# Altium project WB-AV-4510-CAN.PrjPcb (part 1 of 2)
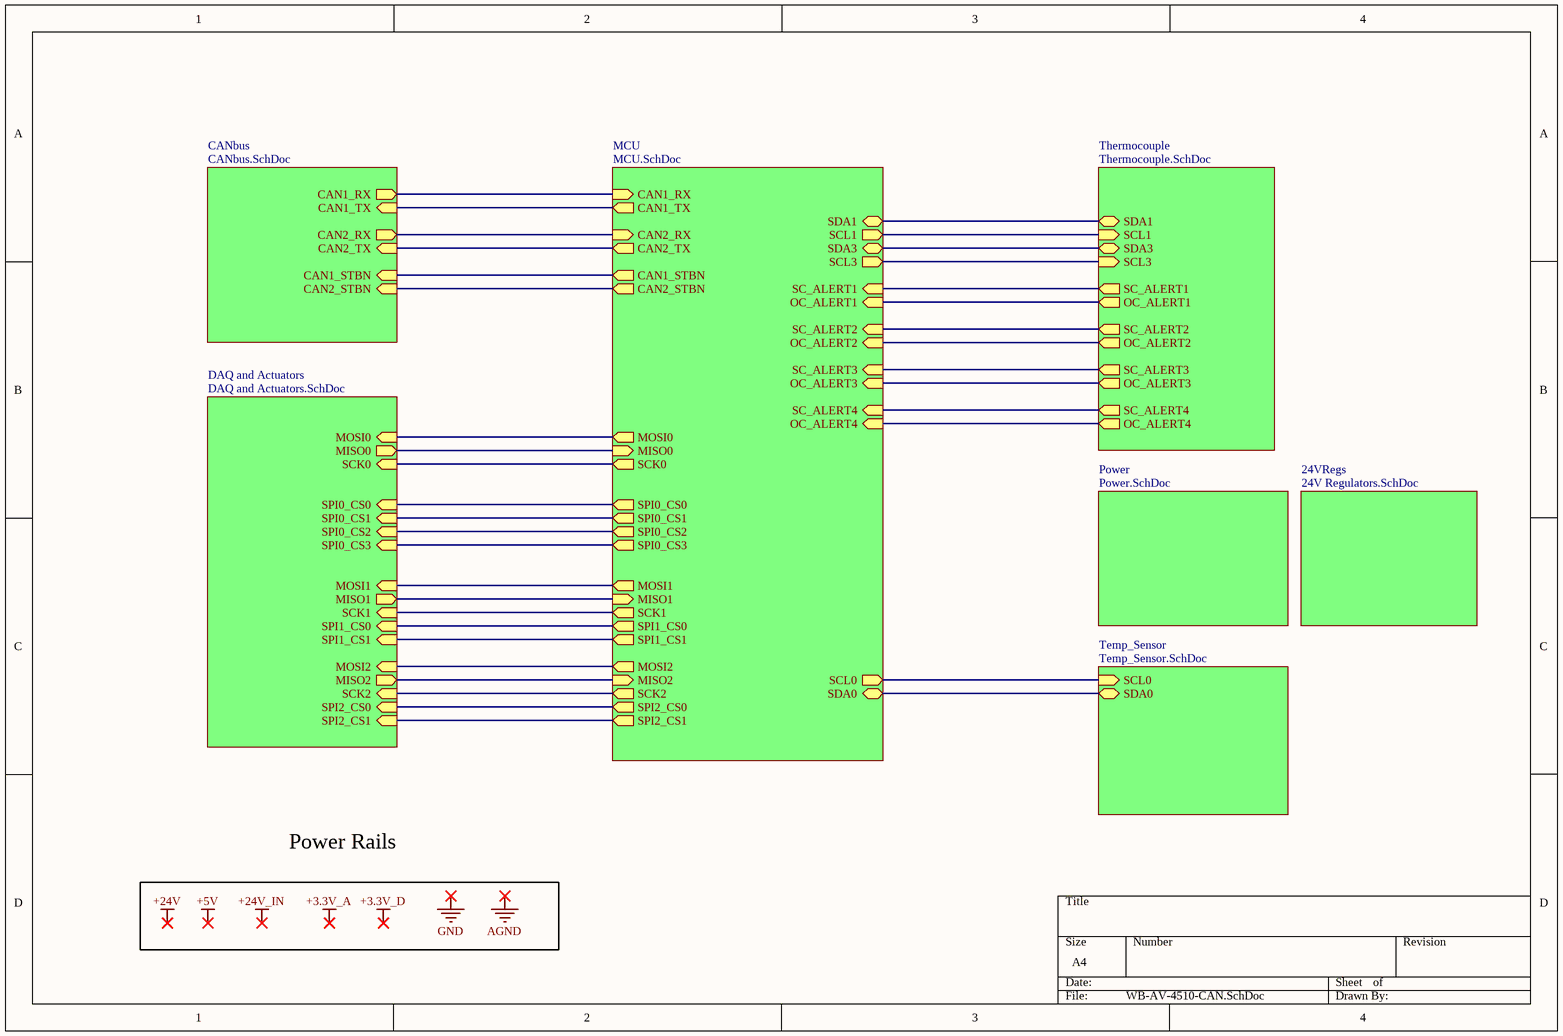
[diagram p0: WB-AV-4510-CAN.SchDoc]
8 sheets, 217 parts. Net scope: hierarchical (ports join the sheet entries above them; power ports are global).
Board file: WB-AV-4510-CAN.PcbDoc
Sheets:
  WB-AV-4510-CAN.SchDoc
    MCU = MCU.SchDoc
    CANbus = CANbus.SchDoc
    DAQ and Actuators = DAQ and Actuators.SchDoc
    Temp_Sensor = Temp_Sensor.SchDoc
    Thermocouple = Thermocouple.SchDoc
    Power = Power.SchDoc
    24VRegs = 24V Regulators.SchDoc

## Sheet WB-AV-4510-CAN.SchDoc
size A4

### Sub-sheets
24VRegs = 24V Regulators.SchDoc: no entries
CANbus = CANbus.SchDoc: CAN1_RX (out), CAN1_TX (in), CAN2_RX (out), CAN2_TX (in), CAN1_STBN (in), CAN2_STBN (in)
DAQ and Actuators = DAQ and Actuators.SchDoc: SCK0 (in), MOSI0 (in), SPI0_CS3 (in), MISO0 (out), SPI0_CS2 (in), SPI0_CS0 (in), SPI0_CS1 (in), MOSI2 (in), MISO2 (out), SCK2 (in), SPI2_CS0 (in), SPI2_CS1 (in), MOSI1 (in), MISO1 (out), SCK1 (in), SPI1_CS0 (in), SPI1_CS1 (in)
MCU = MCU.SchDoc: CAN1_RX (in), CAN1_TX (out), CAN2_RX (in), CAN2_TX (out), CAN1_STBN (out), CAN2_STBN (out), MISO0 (in), MOSI0 (out), SCK0 (out), SCL0 (out), SDA0 (bidir), SPI0_CS2 (out), SPI0_CS1 (out), SPI0_CS3 (out), SPI0_CS0 (out), SPI2_CS1 (out), MOSI2 (out), MISO2 (in), SCK2 (out), SPI2_CS0 (out), SDA1 (bidir), SCL1 (out), SDA3 (bidir), SCL3 (out), SC_ALERT1 (in), OC_ALERT1 (in), SC_ALERT2 (in), OC_ALERT2 (in), SC_ALERT3 (in), OC_ALERT3 (in), SC_ALERT4 (in), OC_ALERT4 (in), MOSI1 (out), MISO1 (in), SPI1_CS0 (out), SCK1 (out), SPI1_CS1 (out)
Power = Power.SchDoc: no entries
Temp_Sensor = Temp_Sensor.SchDoc: SCL0 (in), SDA0 (bidir)
Thermocouple = Thermocouple.SchDoc: SCL1 (in), SDA1 (bidir), SDA3 (bidir), SCL3 (in), SC_ALERT1 (out), OC_ALERT1 (out), SC_ALERT2 (out), OC_ALERT2 (out), SC_ALERT3 (out), OC_ALERT3 (out), SC_ALERT4 (out), OC_ALERT4 (out)

### Nets
MISO0: sheet MCU/MISO0, sheet DAQ and Actuators/MISO0
MISO1: sheet MCU/MISO1, sheet DAQ and Actuators/MISO1
MISO2: sheet MCU/MISO2, sheet DAQ and Actuators/MISO2
MOSI0: sheet MCU/MOSI0, sheet DAQ and Actuators/MOSI0
MOSI1: sheet MCU/MOSI1, sheet DAQ and Actuators/MOSI1
MOSI2: sheet MCU/MOSI2, sheet DAQ and Actuators/MOSI2
SCK0: sheet MCU/SCK0, sheet DAQ and Actuators/SCK0
SCK1: sheet MCU/SCK1, sheet DAQ and Actuators/SCK1
SCK2: sheet MCU/SCK2, sheet DAQ and Actuators/SCK2
SCL1: sheet MCU/SCL1, sheet Thermocouple/SCL1
SCL3: sheet MCU/SCL3, sheet Thermocouple/SCL3
SDA1: sheet MCU/SDA1, sheet Thermocouple/SDA1
SDA3: sheet MCU/SDA3, sheet Thermocouple/SDA3
SPI0_CS0: sheet MCU/SPI0_CS0, sheet DAQ and Actuators/SPI0_CS0
SPI0_CS1: sheet MCU/SPI0_CS1, sheet DAQ and Actuators/SPI0_CS1
SPI0_CS2: sheet MCU/SPI0_CS2, sheet DAQ and Actuators/SPI0_CS2
SPI0_CS3: sheet MCU/SPI0_CS3, sheet DAQ and Actuators/SPI0_CS3
SPI1_CS0: sheet MCU/SPI1_CS0, sheet DAQ and Actuators/SPI1_CS0
SPI1_CS1: sheet MCU/SPI1_CS1, sheet DAQ and Actuators/SPI1_CS1
SPI2_CS0: sheet MCU/SPI2_CS0, sheet DAQ and Actuators/SPI2_CS0
SPI2_CS1: sheet MCU/SPI2_CS1, sheet DAQ and Actuators/SPI2_CS1
NetJ2_1: sheet MCU/CAN1_TX, sheet CANbus/CAN1_TX
NetJ2_2: sheet MCU/CAN1_RX, sheet CANbus/CAN1_RX
NetJ3_1: sheet MCU/CAN2_TX, sheet CANbus/CAN2_TX
NetJ3_2: sheet MCU/CAN2_RX, sheet CANbus/CAN2_RX
NetR20_1: sheet MCU/SDA0, sheet Temp_Sensor/SDA0
NetR21_1: sheet MCU/SCL0, sheet Temp_Sensor/SCL0
NetU1A_5: sheet MCU/CAN1_STBN, sheet CANbus/CAN1_STBN
NetU1B_5: sheet MCU/CAN2_STBN, sheet CANbus/CAN2_STBN
NetU4_123: sheet MCU/OC_ALERT3, sheet Thermocouple/OC_ALERT3
NetU4_124: sheet MCU/SC_ALERT3, sheet Thermocouple/SC_ALERT3
NetU4_125: sheet MCU/OC_ALERT2, sheet Thermocouple/OC_ALERT2
NetU4_126: sheet MCU/SC_ALERT2, sheet Thermocouple/SC_ALERT2
NetU4_127: sheet MCU/OC_ALERT1, sheet Thermocouple/OC_ALERT1
NetU4_128: sheet MCU/SC_ALERT1, sheet Thermocouple/SC_ALERT1
NetU4_129: sheet MCU/OC_ALERT4, sheet Thermocouple/OC_ALERT4
NetU4_130: sheet MCU/SC_ALERT4, sheet Thermocouple/SC_ALERT4

### Notes on the sheet
- Power Rails
- Labels drawn without touching a wire or pin: +3.3V_A, +3.3V_D, +5V, +24V, +24V_IN, AGND, GND

## Sheet MCU.SchDoc
size A3
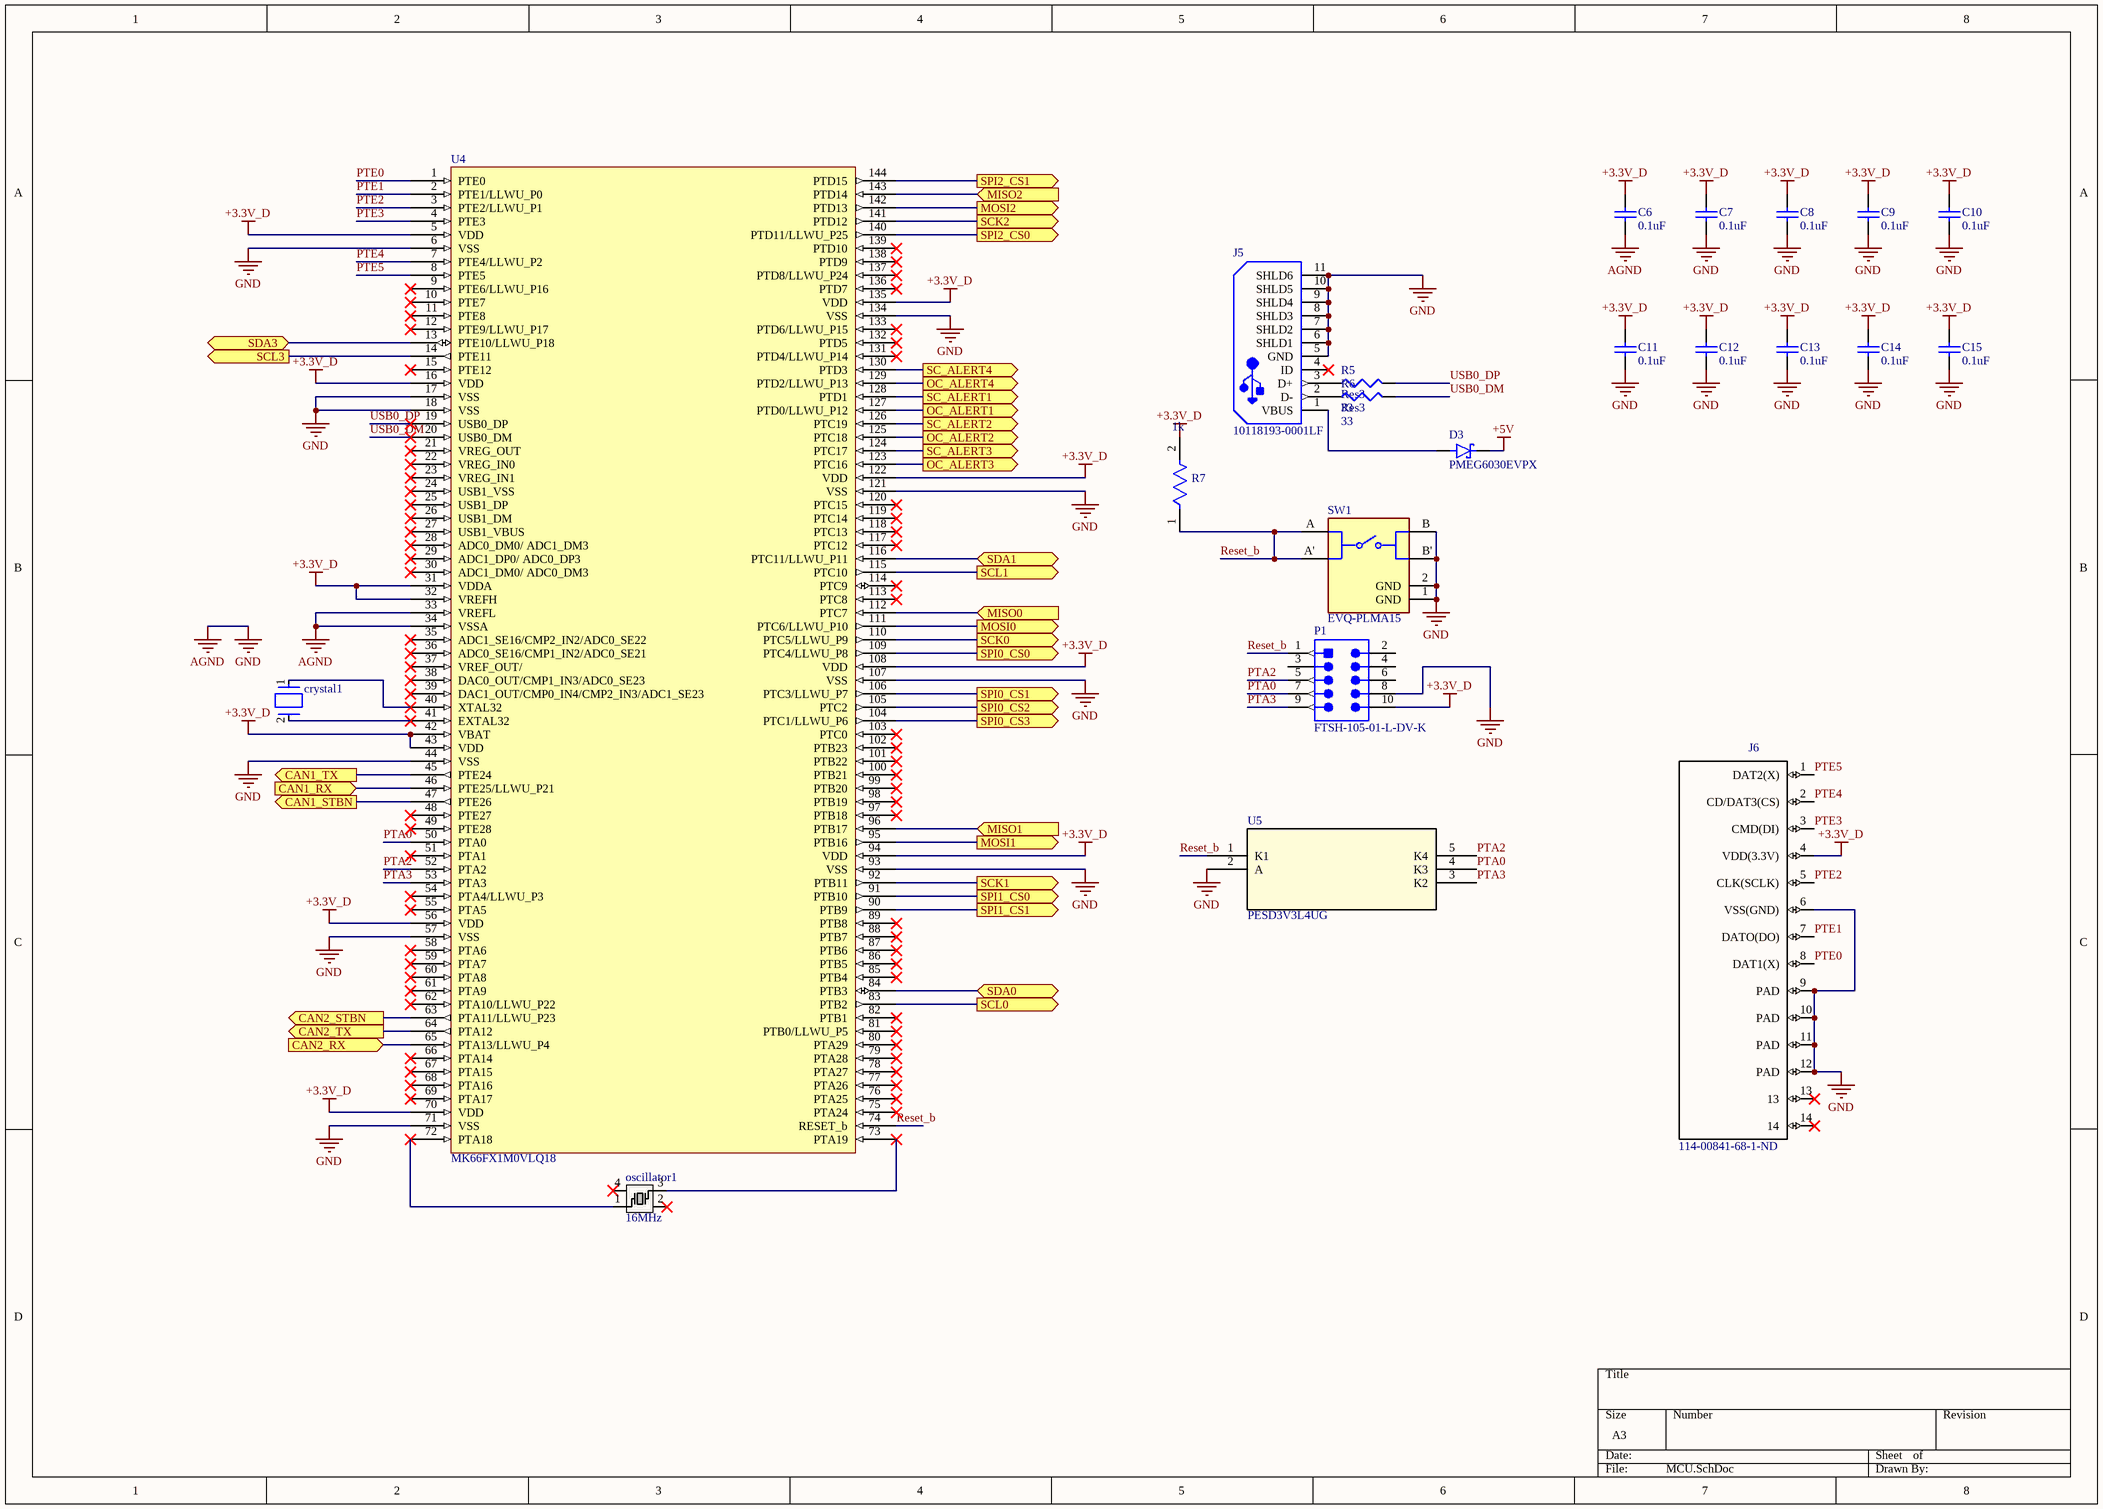
[diagram p1: MCU.SchDoc]

### Parts
C6  0.1uF  [CAPC1608X90X35NL15T15]
C7  0.1uF  [CAPC1608X90X35NL15T15]
C8  0.1uF  [CAPC1608X90X35NL15T15]
C9  0.1uF  [CAPC1608X90X35NL15T15]
C10  0.1uF  [CAPC1608X90X35NL15T15]
C11  0.1uF  [CAPC1608X90X35NL15T15]
C12  0.1uF  [CAPC1608X90X35NL15T15]
C13  0.1uF  [CAPC1608X90X35NL15T15]
C14  0.1uF  [CAPC1608X90X35NL15T15]
C15  0.1uF  [CAPC1608X90X35NL15T15]
crystal1  ABS07-120-32.768KHZ-T  [FP-ABS07-120-MFG]  (value not drawn)
D3  PMEG6030EVPX  [DIO_PMEG6030EVPX]
J5  10118193-0001LF  [FCI-10118193-0001LF-5_V]
J6  Supplier Part Number 1: 114-00841-68-1-ND  [*1140084168]  (hidden comment: 1140084168)
oscillator1  value 16MHz  [ECS-160-8-30B-CKM]  (hidden comment: SMD_oscillator)
P1  FTSH-105-01-L-DV-K  [SMTC-FTSH-105-01-L-DV-K_V]
R5  Res3  value 33  [J1-0603]
R6  Res3  value 33  [J1-0603]
R7  Resistance: 1k  [FP-CRCW0603-e3-MFG]  (hidden comment: CRCW06031K00FKEA)
SW1  EVQ-PLMA15  [FP-EVQ-PLMA15-MFG]
U4  MK66FX1M0VLQ18  [98ASS23177W]
U5  PESD3V3L4UG  [SOT353_NXP]

### Ports
CAN1_RX (in), CAN1_STBN (out), CAN1_TX (out), CAN2_RX (in), CAN2_STBN (out), CAN2_TX (out), MISO0 (in), MISO1 (in), MISO2 (in), MOSI0 (out), MOSI1 (out), MOSI2 (out), OC_ALERT1 (out), OC_ALERT2 (out), OC_ALERT3 (out), OC_ALERT4 (out), SC_ALERT1 (out), SC_ALERT2 (out), SC_ALERT3 (out), SC_ALERT4 (out), SCK0 (out), SCK1 (out), SCK2 (out), SCL0 (out), SCL1 (out), SCL3 (out), SDA0 (bidir), SDA1 (bidir), SDA3 (bidir), SPI0_CS0 (out), SPI0_CS1 (out), SPI0_CS2 (out), SPI0_CS3 (out), SPI1_CS0 (out), SPI1_CS1 (out), SPI2_CS0 (out), SPI2_CS1 (out)

### Nets
+3.3V_D: C6.2 C7.2 C8.2 C9.2 C10.2 C11.2 C12.2 C13.2 C14.2 C15.2 J6.4(VDD(3.3V)) P1.10 R7.2 U4.5(VDD) U4.16(VDD) U4.31(VDDA) U4.32(VREFH) U4.42(VBAT) U4.43(VDD) U4.56(VDD) U4.70(VDD) U4.94(VDD) U4.108(VDD) U4.122(VDD) U4.135(VDD)
+5V: D3.1(K)
AGND: C6.1 C7.1 C8.1 C9.1 C10.1 C11.1 C12.1 C13.1 C14.1 C15.1 J5.5(GND) J5.6(SHLD1) J5.7(SHLD2) J5.8(SHLD3) J5.9(SHLD4) J5.10(SHLD5) J5.11(SHLD6) J6.6(VSS(GND)) J6.9(PAD) J6.10(PAD) J6.11(PAD) J6.12(PAD) P1.8 SW1.1(GND) SW1.2(GND) SW1.B SW1.B' U4.6(VSS) U4.17(VSS) U4.18(VSS) U4.33(VREFL) U4.34(VSSA) U4.44(VSS) U4.57(VSS) U4.71(VSS) U4.93(VSS) U4.107(VSS) U4.121(VSS) U4.134(VSS) U5.2(A)  [also labelled GND]
MISO0: U4.112(PTC7) ; port MISO0
MISO1: U4.96(PTB17) ; port MISO1
MISO2: U4.143(PTD14) ; port MISO2
MOSI0: U4.111(PTC6/LLWU_P10) ; port MOSI0
MOSI1: U4.95(PTB16) ; port MOSI1
MOSI2: U4.142(PTD13) ; port MOSI2
PTA0: P1.7 U4.50(PTA0) U5.4(K3)
PTA2: P1.5 U4.52(PTA2) U5.5(K4)
PTA3: P1.9 U4.53(PTA3) U5.3(K2)
PTE0: J6.8(DAT1(X)) U4.1(PTE0)
PTE1: J6.7(DATO(DO)) U4.2(PTE1/LLWU_P0)
PTE2: J6.5(CLK(SCLK)) U4.3(PTE2/LLWU_P1)
PTE3: J6.3(CMD(DI)) U4.4(PTE3)
PTE4: J6.2(CD/DAT3(CS)) U4.7(PTE4/LLWU_P2)
PTE5: J6.1(DAT2(X)) U4.8(PTE5)
Reset_b: P1.1 R7.1 SW1.A SW1.A' U4.74(RESET_b) U5.1(K1)
SCK0: U4.110(PTC5/LLWU_P9) ; port SCK0
SCK1: U4.92(PTB11) ; port SCK1
SCK2: U4.141(PTD12) ; port SCK2
SCL1: U4.115(PTC10) ; port SCL1
SCL3: U4.14(PTE11) ; port SCL3
SDA1: U4.116(PTC11/LLWU_P11) ; port SDA1
SDA3: U4.13(PTE10/LLWU_P18) ; port SDA3
SPI0_CS0: U4.109(PTC4/LLWU_P8) ; port SPI0_CS0
SPI0_CS1: U4.106(PTC3/LLWU_P7) ; port SPI0_CS1
SPI0_CS2: U4.105(PTC2) ; port SPI0_CS2
SPI0_CS3: U4.104(PTC1/LLWU_P6) ; port SPI0_CS3
SPI1_CS0: U4.91(PTB10) ; port SPI1_CS0
SPI1_CS1: U4.90(PTB9) ; port SPI1_CS1
SPI2_CS0: U4.140(PTD11/LLWU_P25) ; port SPI2_CS0
SPI2_CS1: U4.144(PTD15) ; port SPI2_CS1
USB0_DM: R6.2 U4.20(USB0_DM)
USB0_DP: R5.2 U4.19(USB0_DP)
Netcrystal1_1: crystal1.1 U4.40(XTAL32)
Netcrystal1_2: crystal1.2 U4.41(EXTAL32)
NetD3_2: D3.2(A) J5.1(VBUS)
NetJ2_1: U4.45(PTE24) ; port CAN1_TX
NetJ2_2: U4.46(PTE25/LLWU_P21) ; port CAN1_RX
NetJ3_1: U4.64(PTA12) ; port CAN2_TX
NetJ3_2: U4.65(PTA13/LLWU_P4) ; port CAN2_RX
NetJ5_2: J5.2(D-) R6.1
NetJ5_3: J5.3(D+) R5.1
Netoscillator1_1: oscillator1.1 U4.72(PTA18)
Netoscillator1_3: oscillator1.3 U4.73(PTA19)
NetR20_1: U4.84(PTB3) ; port SDA0
NetR21_1: U4.83(PTB2) ; port SCL0
NetU1A_5: U4.47(PTE26) ; port CAN1_STBN
NetU1B_5: U4.63(PTA11/LLWU_P23) ; port CAN2_STBN
NetU4_123: U4.123(PTC16) ; port OC_ALERT3
NetU4_124: U4.124(PTC17) ; port SC_ALERT3
NetU4_125: U4.125(PTC18) ; port OC_ALERT2
NetU4_126: U4.126(PTC19) ; port SC_ALERT2
NetU4_127: U4.127(PTD0/LLWU_P12) ; port OC_ALERT1
NetU4_128: U4.128(PTD1) ; port SC_ALERT1
NetU4_129: U4.129(PTD2/LLWU_P13) ; port OC_ALERT4
NetU4_130: U4.130(PTD3) ; port SC_ALERT4

Not connected (* = marked no-connect by the designer): J5 4(ID)*; J6 13* 14*; oscillator1 2* 4*; P1 2 3 4 6; U4 9(PTE6/LLWU_P16)* 10(PTE7)* 11(PTE8)* 12(PTE9/LLWU_P17)* 15(PTE12)* 21(VREG_OUT)* 22(VREG_IN0)* 23(VREG_IN1)* 24(USB1_VSS)* 25(USB1_DP)* 26(USB1_DM)* 27(USB1_VBUS)* 28(ADC0_DM0/_ADC1_DM3)* 29(ADC1_DP0/_ADC0_DP3)* 30(ADC1_DM0/_ADC0_DM3)* 35(ADC1_SE16/CMP2_IN2/ADC0_SE22)* 36(ADC0_SE16/CMP1_IN2/ADC0_SE21)* 37(VREF_OUT/)* 38(DAC0_OUT/CMP1_IN3/ADC0_SE23)* 39(DAC1_OUT/CMP0_IN4/CMP2_IN3/ADC1_SE23)* 48(PTE27)* 49(PTE28)* 51(PTA1)* 54(PTA4/LLWU_P3)* 55(PTA5)* 58(PTA6)* 59(PTA7)* 60(PTA8)* 61(PTA9)* 62(PTA10/LLWU_P22)* 66(PTA14)* 67(PTA15)* 68(PTA16)* 69(PTA17)* 75(PTA24)* 76(PTA25)* 77(PTA26)* 78(PTA27)* 79(PTA28)* 80(PTA29)* 81(PTB0/LLWU_P5)* 82(PTB1)* 85(PTB4)* 86(PTB5)* 87(PTB6)* 88(PTB7)* 89(PTB8)* 97(PTB18)* 98(PTB19)* 99(PTB20)* 100(PTB21)* 101(PTB22)* 102(PTB23)* 103(PTC0)* 113(PTC8)* 114(PTC9)* 117(PTC12)* 118(PTC13)* 119(PTC14)* 120(PTC15)* 131(PTD4/LLWU_P14)* 132(PTD5)* 133(PTD6/LLWU_P15)* 136(PTD7)* 137(PTD8/LLWU_P24)* 138(PTD9)* 139(PTD10)*

### Library data of the parts
C6-C15 = CMP-2006-04489-1: Part Number: 0603YC104JAT2A; Manufacturer: AVX Interconnect / Elco
crystal1 = CMP-2000-07587-2: CRYSTAL 32.7680KHZ 6PF SMD; Frequency Tolerance: 20ppm; Series Resistance: 60kR; ESR (Equivalent Series Resistance): 55kR; Depth: 1.5mm; Width: 0.061inch; Number of Pins: 2; Max Operating Temperature: 85°C; Length: 3.2mm; Case/Package: SMD/SMT; Series: ABS07; Lead Free: Lead Free; Min Operating Temperature: -40°C; Load Capacitance: 6pF; Packaging: Tape and Reel; Height: 0.035inch; Radiation Hardening: No; Tolerance: 20ppm; Operating Frequency: 32.768 kHz; Termination: SMD/SMT; REACH SVHC: No SVHC; RoHS Compliant: Yes; Frequency: 32.768kHz; Package Quantity: 3000; Mount: Surface Mount
D3 = PMEG6030EVPX: Diode Schottky 60V 3A Surface Mount SOD-128/CFP5; MF: Nexperia USA; Price: None; Value: *; Package: SOD-128 Nexperia; Availability: Unavailable; SnapEDA_Link: https://www.snapeda.com/parts/PMEG6030EVPX/Nexperia%20USA%20Inc./view-part/2755440/?ref=snap; MP: PMEG6030EVPX
J5 = CMP-2000-05119-1: Micro USB B Type Receptacle, -55 to 85 degC, 5-Pin SMD, RoHS, Tape and Reel; Manufacturer: FCI; Insulation Resistance: 1000MOhms; Gender: Female; Current Rating: 1.8A; Number of Contacts: 5Contact; Connector Type: MicroUSBTypeBreceptacle; Mounting Angle: Right; Datasheet Version: Rev. C, 05/2015; Packaging: Reel; Product Category: USBConnectors; Standard: USB2.0; Factory Pack Quantity: 1200; Operating Temperature Range: -55Cto+85C; Termination Style: SMD/SMT; Datasheet URL: http://datasheet.octopart.com/10118193-0001LF-FCI-datasheet-55953155.pdf; Contact Material: CopperAlloy; RoHS: Details; Contact Plating: Gold; Flammability Rating: UL94V-0; Manufacturer URL: http://www.fci.com/; Brand: FCI; Product: MicroUSBTypeBConnectors; Color: Black
J6 = 1140084168: Conn; IC Socket; Micro SD; Right Angle; PCB Mount; MicroSD Ser.; Manufacturer: Amphenol Commercial; MF: Amphenol ICC; Connector Type: Connector; Number of Contacts: 8; Gender: Receptacle; Pitch: 1.1mm; Package: None; MP: 1140084168; SnapEDA_Link: https://www.snapeda.com/parts/1140084168/Amphenol%20ICC/view-part/?ref=snap; Digi-Key_Purchase_URL: https://www.digikey.ca/product-detail/en/amphenol-icc-commercial-products/114-00841-68/114-00841-68-1-ND/2187101?utm_source=snapeda&utm_medium=aggregator&utm_campaign=symbol; Digi-Key_Part_Number: 114-00841-68-1-ND; Value: *; Supplier 1: Digi-Key; Manufacturer Part Number: 1140084168; RoHS: Yes; Category: Memory Connectors; Stock 1: 27520; Pricing 1: 1=1.28000, 10=1.13000, 25=1.06320, 50=1.01900, 100=0.97480, 250=0.88616, 500=0.79752 (USD); Mount: Surface Mount; Contact Plating: Gold; Housing Material: Polymer; Contact Material: Copper Alloy,Copper; Packaging: Tape and Reel; Orientation: Right Angle; Package Quantity: 7500; Number of Rows: 1; Termination: SMD/SMT; Length: 15.6mm; Height: 1.55mm; Depth: 11.45mm; Radiation Hardening: No; REACH SVHC: Unknown; Flammability Rating: UL94 V-0; Lead Free: Lead Free; ComponentLink1URL: https://datasheet.ciiva.com/24241/11400841-283410-24241569.pdf?src-supplier=Mouser; ComponentLink1Description: https://datasheet.ciiva.com/24241/11400841-283410-24241569.pdf?src-supplier=Mouser; ComponentLink2URL: https://datasheet.ciiva.com/28408/11400841-28408193.pdf?src-supplier=Element14; ComponentLink2Description: https://datasheet.ciiva.com/28408/11400841-28408193.pdf?src-supplier=Element14; ComponentLink3URL: https://datasheet.ciiva.com/9464/1140084168-9464901.pdf?src-supplier=Avnet; ComponentLink3Description: https://datasheet.ciiva.com/9464/1140084168-9464901.pdf?src-supplier=Avnet; ComponentLink4URL: https://datasheet.ciiva.com/48965/70323450-48965706.pdf?src-supplier=Allied+Electronics; ComponentLink4Description: https://datasheet.ciiva.com/48965/70323450-48965706.pdf?src-supplier=Allied+Electronics; ComponentLink5URL: https://datasheet.ciiva.com/16655/1140084168-16655293.pdf?src-supplier=Avnet+Europe; ComponentLink5Description: https://datasheet.ciiva.com/16655/1140084168-16655293.pdf?src-supplier=Avnet+Europe
oscillator1 = ECS-160-8-30B-CKM: SPN: XC1839CT-ND
P1 = CMP-2000-05353-1: Male Header, Pitch 1.27 mm, 2 x 5 Position, Height 6.25 mm; Manufacturer: Samtec; Pitch: 0.050"(1.27mm); Other Names: Q3937619; Number of Positions: 10; Mating Products: SFMC-105-L2-S-D-TR-ND / -CONN.05"SURFACE10POSSMT / FLE-105-01-G-DV-TR-ND / -CONNSKT1.27MM10POSDUALSMD / FLE-105-01-G-DV-A-P-ND / -CONNSKT1.27MM10POSDUALSMD / FLE-105-01-G-DV-A-ND / -CONNSKT1.27MM10POSDUALSMD / CLP-105-02-G-D-P-TR-ND / -CONNRCPT10POSDUAL.05"SMD / SAM1155-05-ND / -CONNRCPT10POSDUAL.05"SMD / SAM1154-05-ND / -CONNRCPT10POSDUAL.05"SMD / SAM1153-05-ND / -CONNRCPT10POSDUAL.05"SMD / SAM1226-05-ND / -CONNRCPT.05"10POSDUALSMD; Number of Positions Loaded: All; Connector Type: Header,Unshrouded; Product Training Modules: Board-to-BoardConnectors; Datasheet Version: Rev. ET, 10/1995; Number of Rows: 2; Standard Package: 1; Package Description: Male Header, Pitch 1.27 mm, 2 x 5 Position, Height 5.97 mm, Tail Length 4.32 mm; Contact Finish Thickness: 10µin(0.25µm); Series: FTSH; Termination: Solder; Contact Type: MalePin; Color: Black; Package Reference: FTSH-105-01-L-DV-K; Family: RectangularConnectors-Headers,MalePins; Package URL: http://suddendocs.samtec.com/prints/ftsh-1xx-xx-xxx-dv-xxx-footprint.pdf; Packaging: Tube; Mounting Type: SurfaceMount; Category: Connectors,Interconnects; Datasheet URL: http://suddendocs.samtec.com/prints/ftsh-1xx-xx-xxx-dv-xxx-mkt.pdf; Row Spacing: 0.050"(1.27mm); Manufacturer URL: http://www.samtec.com/; Contact Mating Length: 0.120"(3.05mm); Contact Finish: Gold
R5 R6 = Res3: VISHAY - CRCW060333R0FKEA. - Resistore su Chip a Mont. Superficiale, Film Spesso, 0603 [1608 Metrico], 33 ohm, Serie CRCW, 75 V; SPN: 541-2782-1-ND; Resistance: 33R; Tolerance: 1%; Temperature Coefficient: 100ppm/°C; Power Rating: 100mW; Voltage Rating: 75V; Published: 8-Jun-2000; LatestRevisionDate: 29-May-2009; LatestRevisionNote: IPC-7351 Footprint Added.; PackageReference: J1-0603; Publisher: Altium Limited; PackageDescription: Chip Resistor; Supplier 1: Digi-Key; Supplier Part Number 1: 541-33.0HCT-ND; Manufacturer: Vishay; Manufacturer Part Number: CRCW060333R0FKEA; RoHS: Yes; Category: Chip SMD Resistors; Stock 1: 59910; Pricing 1: 1=0.10000, 10=0.03300, 100=0.01340, 1000=0.00602, 2500=0.00522 (USD); Mount: Surface Mount; Case/Package: 0603; Weight: 7.1E-05oz; Case Code (Imperial): 0603; Case Code (Metric): 1608; Contact Plating: Tin; Min Operating Temperature: -55°C; Max Operating Temperature: 155°C; Composition: Thick Film; Packaging: Tape and Reel; Number of Terminations: 2; Max Power Dissipation: 100mW; Voltage Rating (DC): 75V; Package Quantity: 10; Military Standard: Not; Termination: SMD/SMT; Features: Automotive AEC-Q200; Length: 1.55mm; Height: 0.45mm; Width: 0.85mm; Depth: 0.85mm; Radiation Hardening: No; Lead Free: Lead Free; REACH SVHC: Unknown; ComponentLink1URL: https://datasheet.ciiva.com/11809/0900766b80d98afc-11809158.pdf?src-supplier=RSComponents; ComponentLink1Description: https://datasheet.ciiva.com/11809/0900766b80d98afc-11809158.pdf?src-supplier=RSComponents; ComponentLink2URL: https://datasheet.ciiva.com/7777/1697337-7777317.pdf?src-supplier=Element14; ComponentLink2Description: https://datasheet.ciiva.com/7777/1697337-7777317.pdf?src-supplier=Element14; ComponentLink3URL: https://datasheet.ciiva.com/7777/1720486-7777557.pdf?src-supplier=Element14; ComponentLink3Description: https://datasheet.ciiva.com/7777/1720486-7777557.pdf?src-supplier=Element14; ComponentLink4URL: https://datasheet.ciiva.com/16783/70201119-16783349.pdf?src-supplier=Allied+Electronics; ComponentLink4Description: https://datasheet.ciiva.com/16783/70201119-16783349.pdf?src-supplier=Allied+Electronics; ComponentLink5URL: https://datasheet.ciiva.com/7777/1720486-7777558.pdf?src-supplier=Element14; ComponentLink5Description: https://datasheet.ciiva.com/7777/1720486-7777558.pdf?src-supplier=Element14; ComponentLink6URL: https://datasheet.ciiva.com/16771/70201119-16771126.pdf?src-supplier=Allied+Electronics; ComponentLink6Description: https://datasheet.ciiva.com/16771/70201119-16771126.pdf?src-supplier=Allied+Electronics; ComponentLink7URL: https://datasheet.ciiva.com/2465/dcrcwe3-2465591.pdf?src-supplier=Digi-Key; ComponentLink7Description: https://datasheet.ciiva.com/2465/dcrcwe3-2465591.pdf?src-supplier=Digi-Key; ComponentLink8URL: https://datasheet.ciiva.com/2465/dcrcwe3-2465592.pdf?src-supplier=Digi-Key; ComponentLink8Description: https://datasheet.ciiva.com/2465/dcrcwe3-2465592.pdf?src-supplier=Digi-Key; ComponentLink9URL: https://datasheet.ciiva.com/2465/dcrcwe3-2465593.pdf?src-supplier=Digi-Key; ComponentLink9Description: https://datasheet.ciiva.com/2465/dcrcwe3-2465593.pdf?src-supplier=Digi-Key; ComponentLink10URL: https://datasheet.ciiva.com/16893/dcrcwe3-16893242.pdf?src-supplier=Avnet+Europe; ComponentLink10Description: https://datasheet.ciiva.com/16893/dcrcwe3-16893242.pdf?src-supplier=Avnet+Europe
R7 = CMP-1666-00003-5: RES Thick Film, 1kΩ, 1%, 0.1W, 100ppm/°C, 0603; Max Power Dissipation: 100mW; Voltage Rating: 75V; Max Operating Temperature: 155°C; Number of Pins: 2; Case Code (Imperial): 0603; Width: 0.033inch; Power Rating: 100mW; Number of Terminations: 2; Package Quantity: 10; Weight: 7.1E-05oz; Tolerance: 1%; Temperature Coefficient: 100ppm/°C; Military Standard: Not; Mount: Surface Mount; Voltage Rating (DC): 75V; Depth: 0.85mm; Composition: Thick Film; Radiation Hardening: No; Termination: SMD/SMT; Length: 1.55mm; Case Code (Metric): 1608; Contact Plating: Tin; Min Operating Temperature: -55°C; Packaging: Tape and Reel; Height: 0.45mm; Lead Free: Lead Free; Case/Package: 0603; Features: Automotive AEC-Q200
SW1 = CMP-05618-000006-1: SWITCH TACTILE SPST-NO 0.02A 15V; Manufacturer: Panasonic Electronic Components; Operating Force: 2.6N; Contact Resistance: 50mΩ; Contact Current Rating: 20mA; Electromechanical Life: 200000Cycles; Throw Configuration: SPST-NO; Automotive: No; Digikey Description: SWITCH TACTILE SPST-NO 0.02A 15V; Device Class L3: Tactile Switches; Device Class L2: Switches; Temperature Range Low: -20°C; ComponentLink2Description: Datasheet; RoHS: TRUE; Mount: Surface Mount; Package: 0; Height: 1.7mm; Octopart: https://octopart.com/evq-plma15-panasonic-39850235; Temperature Range High: +70°C; Device Class L1: Electromechanical; Category: Switch; Mouser Description: Tactile Switches FLAT ACT 2.6NF 4.6x3.4x1.5mm; Voltage Rating Dc: 15V; Manufacturer Part Number: EVQ-PLMA15; ComponentLink2URL: https://datasheet.ciiva.com/8164/atv0000ce2-8164994.pdf; Lead Free: Yes; Temperature: -20°C to +70°C
U4 = Component_1
U5 = PESD3V3L4UG: No Description Available; Vendor: NXP; Built_By: EMA_UL_Team; SourceLibrary: NXP_2011-11-10; Manufacturer_Part_Number: PESD3V3L4UG; Copyright: Copyright (C) 2018 Accelerated Designs. All rights reserved; RefDes: RefDes; Type: DEV

## Sheet CANbus.SchDoc
size A4
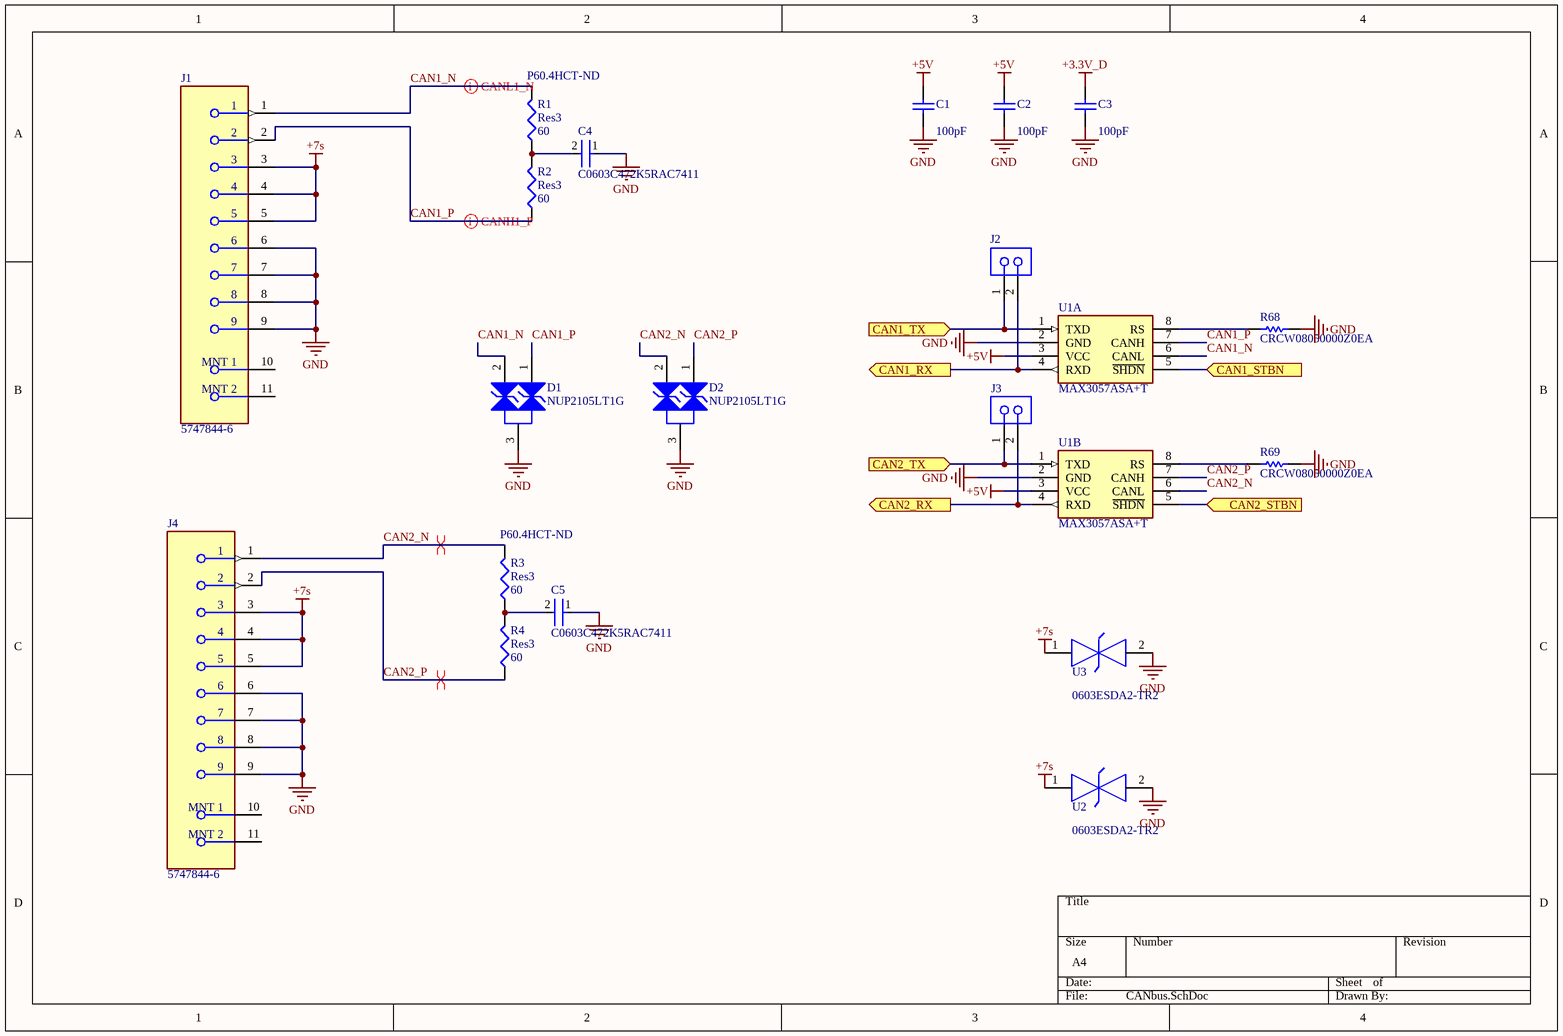
[diagram p2: CANbus.SchDoc]

### Parts
C1  value 100pF  [CAPC1608X90X35NL10T15]  (hidden comment: GRM1885C1H101JA01D)
C2  value 100pF  [CAPC1608X90X35NL10T15]  (hidden comment: GRM1885C1H101JA01D)
C3  value 100pF  [CAPC1608X90X35NL10T15]  (hidden comment: GRM1885C1H101JA01D)
C4  C0603C472K5RAC7411  [FP-C0603C-CF-MFG]
C5  C0603C472K5RAC7411  [FP-C0603C-CF-MFG]
D1  NUP2105LT1G  [ONSC-SOT-23-3-318-08_V]
D2  NUP2105LT1G  [ONSC-SOT-23-3-318-08_V]
J1  5747844-6  [FP-5747844-6-MFG]
J2  SSW-102-02-T-S  [SMTC-SSW-102-02-X-S]  (value not drawn)
J3  SSW-102-02-T-S  [SMTC-SSW-102-02-X-S]  (value not drawn)
J4  5747844-6  [FP-5747844-6-MFG]
R1  Res3  value 60  Supplier Part Number 1: P60.4HCT-ND  [J1-0603]
R2  Res3  value 60  [J1-0603]
R3  Res3  value 60  Supplier Part Number 1: P60.4HCT-ND  [J1-0603]
R4  Res3  value 60  [J1-0603]
R68  CRCW08050000Z0EA  [RESC2013X50X30LL20T20]
R69  CRCW08050000Z0EA  [RESC2013X50X30LL20T20]
U1A  MAX3057ASA+T  [SOIC127P600X175-8N]
U1B  MAX3057ASA+T  [SOIC127P600X175-8N]
U2  0603ESDA2-TR2  [Eaton_0603ESDA_0]  (value not drawn)
U3  0603ESDA2-TR2  [Eaton_0603ESDA_0]  (value not drawn)

### Ports
CAN1_RX (out), CAN1_STBN (in), CAN1_TX (in), CAN2_RX (out), CAN2_STBN (in), CAN2_TX (in)

### Nets
+3.3V_D: C3.2
+5V: C1.2 C2.2 U1A.3(VCC) U1B.3(VCC)
+7s: J1.3 J1.4 J1.5 J4.3 J4.4 J4.5 U2.1 U3.1
GND: C1.1 C2.1 C3.1 C4.1 C5.1 D1.3(K) D2.3(K) J1.6 J1.7 J1.8 J1.9 J4.6 J4.7 J4.8 J4.9 R68.2 R69.2 U1A.2(GND) U1B.2(GND) U2.2 U3.2  [project net AGND]
CAN1_N: D1.2(K) J1.1 R1.2 U1A.6(CANL)
CAN1_P: D1.1(K) J1.2 R2.1 U1A.7(CANH)
CAN2_N: D2.2(K) J4.1 R3.2 U1B.6(CANL)
CAN2_P: D2.1(K) J4.2 R4.1 U1B.7(CANH)
NetC4_2: C4.2 R1.1 R2.2
NetC5_2: C5.2 R3.1 R4.2
NetJ2_1: J2.1 U1A.1(TXD) ; port CAN1_TX
NetJ2_2: J2.2 U1A.4(RXD) ; port CAN1_RX
NetJ3_1: J3.1 U1B.1(TXD) ; port CAN2_TX
NetJ3_2: J3.2 U1B.4(RXD) ; port CAN2_RX
NetR68_1: R68.1 U1A.8(RS)
NetR69_1: R69.1 U1B.8(RS)
NetU1A_5: U1A.5(~{SHDN}) ; port CAN1_STBN
NetU1B_5: U1B.5(~{SHDN}) ; port CAN2_STBN

Not connected (* = marked no-connect by the designer): J1 10(MNT_1) 11(MNT_2); J4 10(MNT_1) 11(MNT_2)

### Layout directives
differential pair: CAN1_N, CAN1_P, CAN2_N, CAN2_P

### Library data of the parts
C1-C3 = CMP-2006-02595-1: Manufacturer: Murata; Part Number: GRM1885C1H101JA01D
C4 C5 = CMP-03020-003188-1: C0603 4,700 pF X7R 30ppm/°C 10.00% 50 V; Manufacturer: KEMET; Automotive Grade: Grade 1; Voltage Rating: 50 V; Material: Ceramic; Tolerance: 0.1; Capacitance: 4,700 pF; Manufacturer Part Number: C0603C472K5RAC7411; ComponentLink2URL: https://api.kemet.com/component-edge/download/datasheet/C0603C100J5GACAUTO.pdf; Value: 4,700 pF; RoHS: TRUE; Automotive: Yes; Package: C0603C-CF; Device Class L1: Passive Components; Temperature Coefficient: 30ppm/°C; Octopart: https://octopart.com/c0603c472k5rac7411-kemet-3746251; Temperature Range Low: -55°C; Height: 0.87mm; Device Class L2: Capacitors; Lead Free: Yes; ComponentLink2Description: Datasheet; Temperature: -55°C to +125°C; Temperature Range High: +125°C; Temperature Characteristic: X7R; Device Class L3: Ceramic Capacitors; Category: Cap
D1 D2 = CMP-1063-00164-1: Dual Line CAN Bus Protector, 3-Pin SOT-23, Pb-Free, Tape and Reel; Manufacturer: On Semiconductor; IR Max (uA): 0.1; Number of Lines: 2; Direction: Bidirectional; C Max (pF): 30; PPK Max (W): 350; V(BR) Min (V): 26.2; ComponentLink3URL: http://www.onsemi.cn/pub_link/Collateral/318-08.PDF; Mounting Technology: Surface Mount; ComponentLink2Description: Datasheet; PartNumber: NUP2105LT1G; ComponentLink1URL: http://www.onsemi.com/; PackageVersion: Rev. AP, 11/2009; DatasheetVersion: Rev. 5; RoHS: Pb-Free; PackageReference: SOT-23-3-318-08; ComponentLink2URL: http://www.onsemi.cn/pub_link/Collateral/NUP2105L-D.PDF; ComponentLink1Description: Manufacturer URL; PackageDescription: 3-Pin Small Outline Transistor, Body 2.92 x 1.3 mm, Pitch 0.95 mm; Packing: Tape and Reel; ComponentLink3Description: Package Specification
J1 J4 = CMP-2000-07496-2: CONN D-SUB RCPT 9POS R/A SOLDER; Manufacturer: TE Connectivity; Conn Gender: Female; Pitch: 2.74mm; Is Female: yes; Ciiva Ids: 587108; Current Rating: 6A; Conn Orientation: Right Angle; Number Of Contacts: 9; Import Ts: 1521841921; Shielding: true; ComponentLink2URL: https://www.te.com/commerce/DocumentDelivery/DDEController?Action=showdoc&DocId=Catalog+Section%7F82068_AMPLIMITE_Right-Angle_Posted_Conn%7F0412%7Fpdf%7FEnglish%7FENG_CS_82068_AMPLIMITE_Right-Angle_Posted_Conn_0412.pdf%7F5747844-6; Footprint Url: https://www.te.com/commerce/DocumentDelivery/DDEController?Action=showdoc&DocId=Customer+Drawing%7F5747844%7FP%7Fpdf%7FEnglish%7FENG_CD_5747844_P.pdf%7F5747844-6; ComponentLink2Description: Datasheet; Category: Conn; Height: 12.9286mm; RoHS: TRUE; Lead Free: Yes; Automotive: No; Octopart: https://octopart.com/5747844-6-te+connectivity-46505427; Package: 5747844-6; Release Date: 1508999366; Device Class L3: unset; Temperature Range High: +105°C; Contact Material: Gold,Tin; Digikey Description: CONN D-SUB RCPT 9POS R/A SOLDER; Device Class L1: Connectors; Device Class L2: D-Sub Connectors; Temperature Range Low: -55°C; Temperature: -55°C to +105°C; Mouser Description: D-Sub Standard Connectors 9 PIN RECEPTACLE; Manufacturer Part Number: 5747844-6
J2 J3 = CMP-1023-00323-1: SQ Post Socket, Through-hole, Vertical, -55 to 105 degC, 2.54 mm Pitch, 2-Pin, Female, RoHS; Manufacturer: Samtec; Pitch: 2.54 mm; ComponentLink3Description: Package Specification; ComponentLink2Description: Datasheet; ComponentLink1Description: Manufacturer URL; PackageVersion: CA, 6/1987; DatasheetVersion: F-214; PackageDescription: Assembly, Socket Strip .016 X .031 Tail; ComponentLink2URL: http://www.samtec.com/documents/webfiles/pdf/SSW_TH.PDF; RoHS: True; ComponentLink3URL: http://www.samtec.com/documents/webfiles/cpdf/SSW-1XX-XX-XXX-X-XX-XXX-XX-MKT.pdf; ComponentLink1URL: http://www.samtec.com; PackageReference: SSW-102-02-X-S; Mounting Technology: Through-hole; Orientation: Vertical; Temperature Range: -55 to 105 degC; PartNumber: SSW-102-02-T-S
R1-R4 = Res3: RESISTOR, 0603, 60R4 1%, 0.1W; Manufacturer: Panasonic; Manufacturer Part Number: ERJ-3EKF60R4V; Resistance: 60.4R; Power Rating: 100mW; Temperature Coefficient: 100ppm/°C; Voltage Rating: 75V; Voltage Rating (DC): 50V; Published: 8-Jun-2000; LatestRevisionDate: 29-May-2009; LatestRevisionNote: IPC-7351 Footprint Added.; PackageReference: J1-0603; Publisher: Altium Limited; PackageDescription: Chip Resistor; Supplier 1: Digi-Key; RoHS: Yes; Category: Chip SMD Resistors; Stock 1: 97677; Pricing 1: 1=0.10000, 10=0.05400, 100=0.02190, 1000=0.00983, 2500=0.00853 (USD); Mount: Surface Mount; Case/Package: 0603; Case Code (Metric): 1608; Case Code (Imperial): 0603; Contact Plating: Tin; Min Operating Temperature: -55°C; Max Operating Temperature: 155°C; Tolerance: 1%; Packaging: Tape and Reel; Composition: Thick Film; Number of Terminations: 2; Package Quantity: 1; Termination: SMD/SMT; Max Power Dissipation: 100mW; Military Standard: Not; Features: Automotive AEC-Q200; Length: 1.6mm; Height: 0.022inch; Width: 0.031inch; Depth: 0.8mm; REACH SVHC: No SVHC; Lead Free: Lead Free; ComponentLink1URL: https://datasheet.ciiva.com/28594/1678782-28594695.pdf?src-supplier=Element14; ComponentLink1Description: https://datasheet.ciiva.com/28594/1678782-28594695.pdf?src-supplier=Element14; ComponentLink2URL: https://datasheet.ciiva.com/30163/aoa0000ce2-30163208.pdf?src-supplier=Onlinecomponents.com; ComponentLink2Description: https://datasheet.ciiva.com/30163/aoa0000ce2-30163208.pdf?src-supplier=Onlinecomponents.com; ComponentLink3URL: https://datasheet.ciiva.com/5951/426256-5951371.pdf?src-supplier=Farnell; ComponentLink3Description: https://datasheet.ciiva.com/5951/426256-5951371.pdf?src-supplier=Farnell; ComponentLink4URL: https://datasheet.ciiva.com/16757/70260748-16757877.pdf?src-supplier=Allied+Electronics; ComponentLink4Description: https://datasheet.ciiva.com/16757/70260748-16757877.pdf?src-supplier=Allied+Electronics; ComponentLink5URL: https://datasheet.ciiva.com/24068/aoa0000ce2-24068761.pdf?src-supplier=Mouser; ComponentLink5Description: https://datasheet.ciiva.com/24068/aoa0000ce2-24068761.pdf?src-supplier=Mouser; ComponentLink6URL: https://datasheet.ciiva.com/16783/70260748-16783402.pdf?src-supplier=Allied+Electronics; ComponentLink6Description: https://datasheet.ciiva.com/16783/70260748-16783402.pdf?src-supplier=Allied+Electronics; ComponentLink7URL: https://datasheet.ciiva.com/28677/1678782-28677676.pdf?src-supplier=Element14; ComponentLink7Description: https://datasheet.ciiva.com/28677/1678782-28677676.pdf?src-supplier=Element14; ComponentLink8URL: https://datasheet.ciiva.com/43460/426256-43460428.pdf?src-supplier=Farnell; ComponentLink8Description: https://datasheet.ciiva.com/43460/426256-43460428.pdf?src-supplier=Farnell; ComponentLink9URL: https://datasheet.ciiva.com/46377/426256-46377437.pdf?src-supplier=Element14; ComponentLink9Description: https://datasheet.ciiva.com/46377/426256-46377437.pdf?src-supplier=Element14
  R2 R4: Supplier Part Number 1: P60.4HCT-ND
R68 R69 = CMP-2001-04896-1: Manufacturer: Vishay Dale; Part Number: CRCW08050000Z0EA
U1A U1B = MAX3057ASA+T: Integrated Circuit; Manufacturer_Name: Maxim Integrated; Datasheet Link: https://datasheets.maximintegrated.com/en/ds/MAX3050-MAX3057.pdf; Height: 1.75mm; Manufacturer_Part_Number: MAX3057ASA+T
U2 U3 = 0603ESDA2-TR2: DIODE SUPPRESSOR ESD 30VDC 0603 SMD; Manufacturer: Eaton; Capacitance: SKIP; Clamping Voltage: 35V; Direction: Bidirectional; Library Path1: parts/Diode_Eaton_0603ESDA2-TR2_eec.SchLib; Peak Pulse Current: 30A; Value: SKIP; Verification Version: 0.0.0.1; Part Number: 0603ESDA2-TR2; Datasheet Path: datasheets/Diode_Eaton_0603ESDA2-TR2_eec.pdf; ComponentLink1Description: Upverter; ComponentLink1URL: https://upverter.com/upn/revision/b9b7301627e297c3/; ComponentLink2Description: Datasheet; ComponentLink2URL: http://www.cooperindustries.com/content/dam/public/bussmann/Electronics/Resources/product-datasheets/bus-elx-ds-4419-0603esda2-tr2.pdf; Datasheet Path1: datasheets/Diode_Eaton_0603ESDA2-TR2_eec.pdf; Digikey Description: DIODE SUPPRESSOR ESD 30VDC 0603 SMD; Digikey Part Number: 283-4156-1-ND; Height: 0.7mm; Inductance: SKIP; Lead Free: yes; Library Ref1: 0603ESDA2-TR2; Mouser Description: MLP Series 60 V 0.1 pF Bi-Directional 0603 Surface Mount ESD Suppressor; Mouser Part Number: 504-0603ESDA2-TR2; Package: 0603ESDA; Price: 0.211194288872; Resistance: SKIP; RoHS: TRUE; Supplier 1: Digi-Key; Supplier 2: Mouser; Supplier Part Number 1: 283-4156-1-ND; Supplier Part Number 2: 504-0603ESDA2-TR2; Temperature: -55°C to +105°C; Temperature Range High: +105°C; Temperature Range Low: -55°C; Voltage: SKIP; helpURL: https://upverter.com/upn/revision/b9b7301627e297c3/

## Sheet DAQ and Actuators.SchDoc
size A3
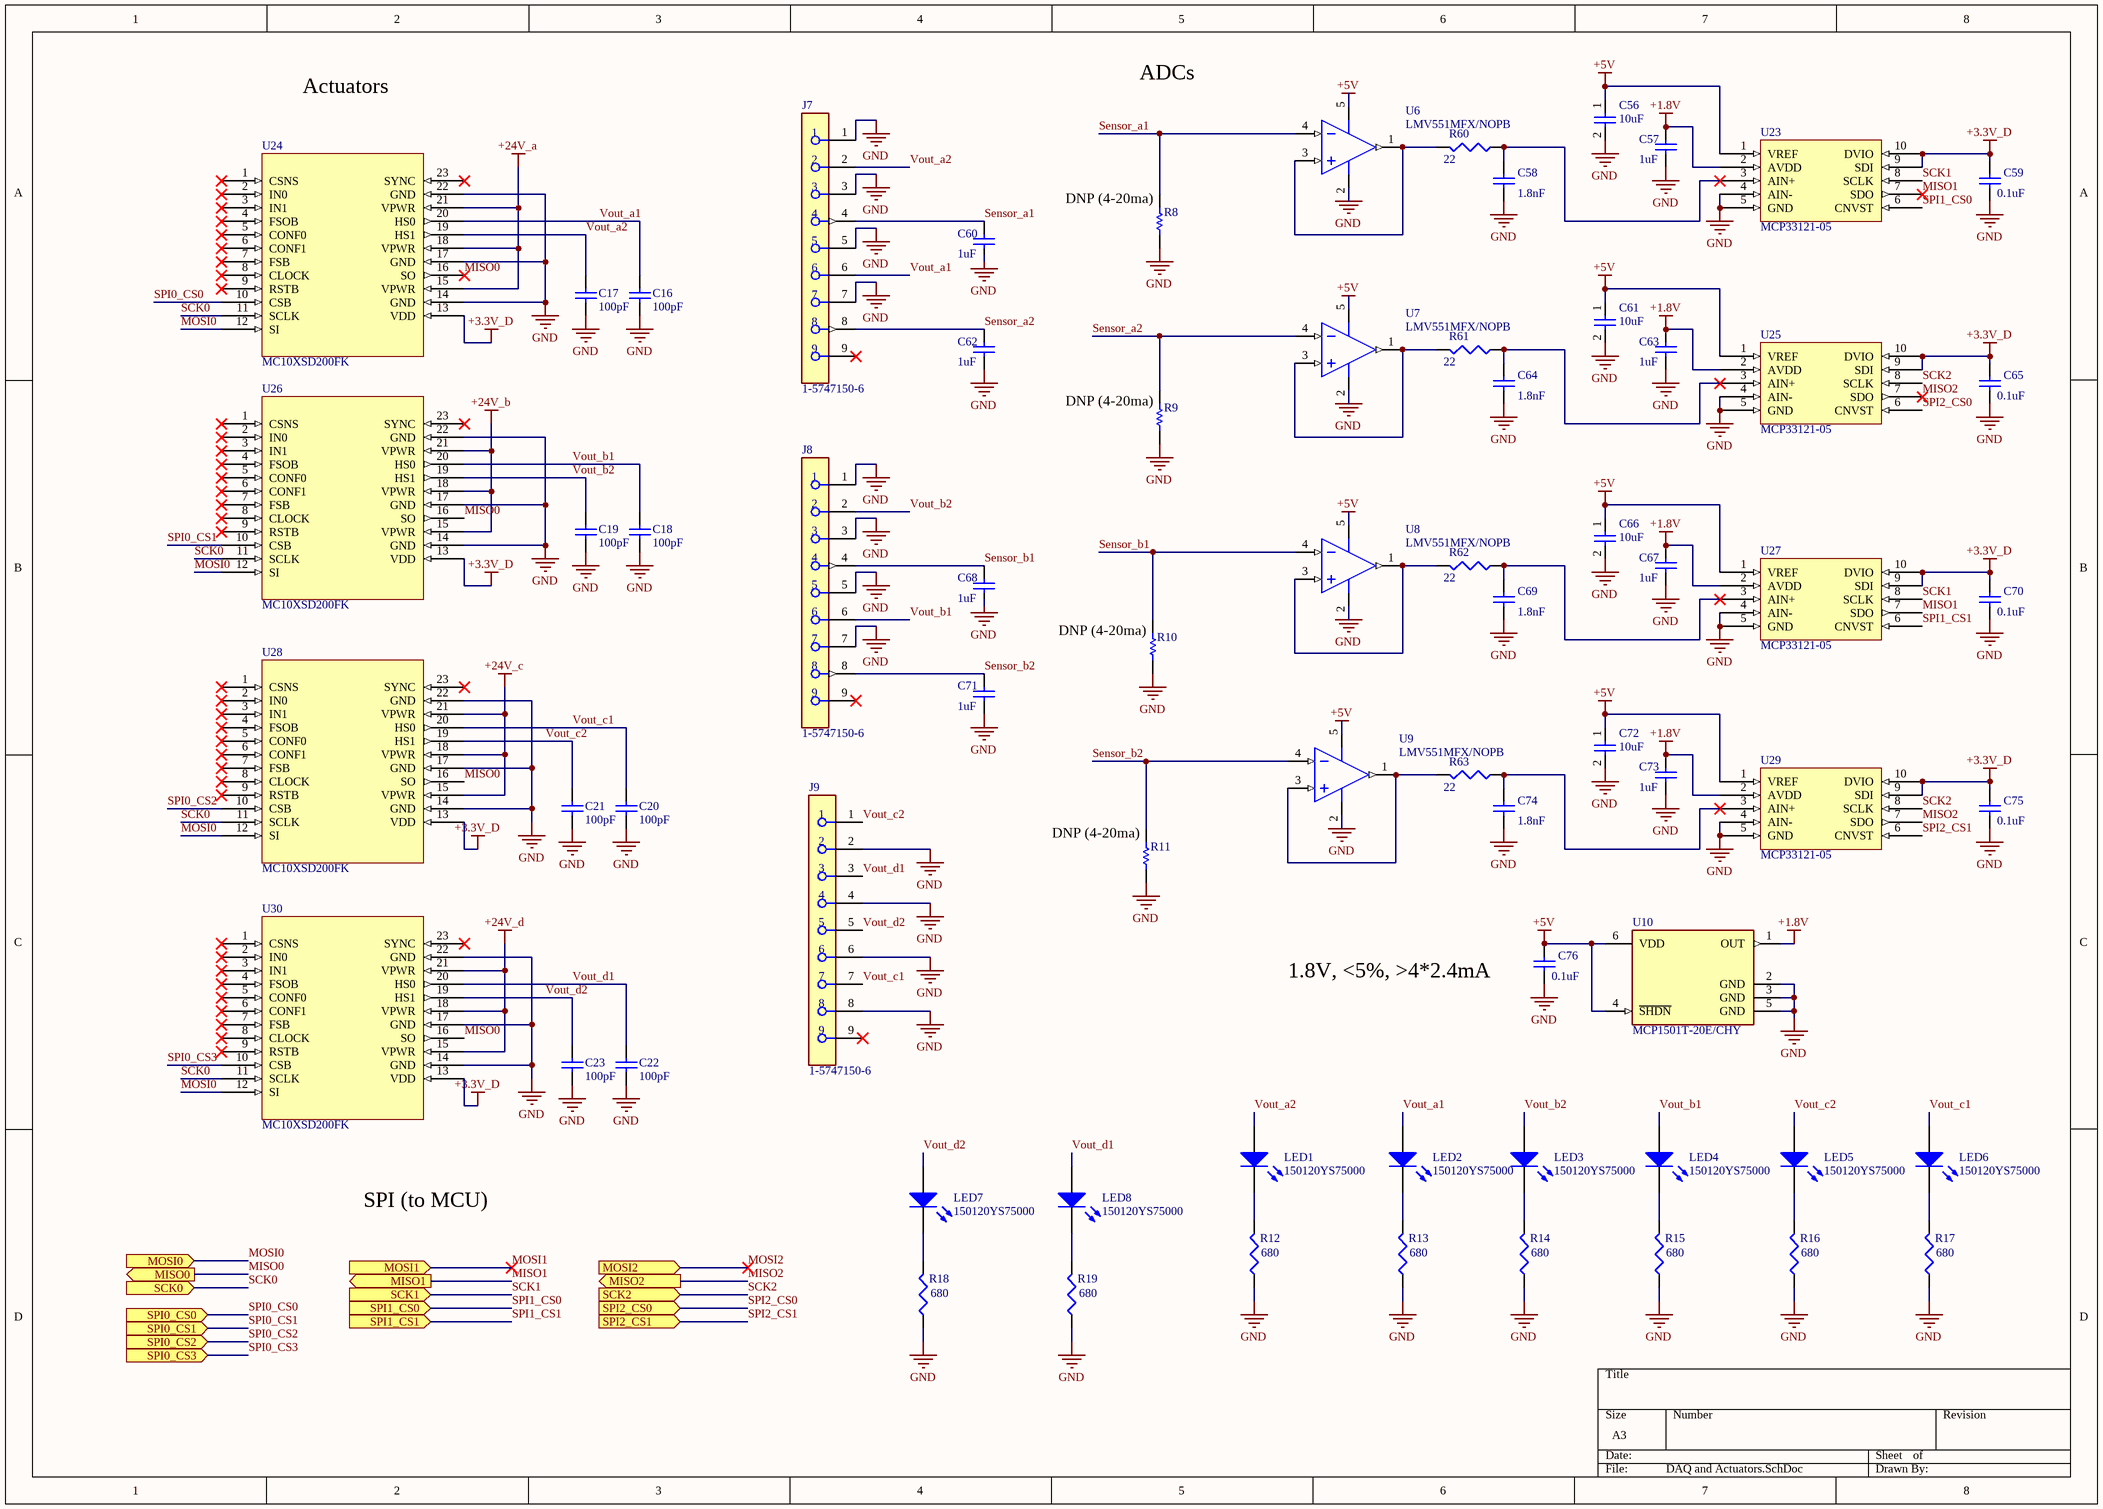
[diagram p3: DAQ and Actuators.SchDoc]

### Parts
C16  value 100pF  [CAPC1608X95X40LL15T15]  (hidden comment: Cap)
C17  value 100pF  [CAPC1608X95X40LL15T15]  (hidden comment: Cap)
C18  value 100pF  [CAPC1608X95X40LL15T15]  (hidden comment: Cap)
C19  value 100pF  [CAPC1608X95X40LL15T15]  (hidden comment: Cap)
C20  value 100pF  [CAPC1608X95X40LL15T15]  (hidden comment: Cap)
C21  value 100pF  [CAPC1608X95X40LL15T15]  (hidden comment: Cap)
C22  value 100pF  [CAPC1608X95X40LL15T15]  (hidden comment: Cap)
C23  value 100pF  [CAPC1608X95X40LL15T15]  (hidden comment: Cap)
C56  value 10uF  [0603 CAP POLARIZED]  (hidden comment: Cap)
C57  value 1uF  [1608[0603]]  (hidden comment: Cap)
C58  value 1.8nF  [1608[0603]]  (hidden comment: Cap)
C59  value 0.1uF  [1608[0603]]  (hidden comment: Cap)
C60  value 1uF  [1608[0603]]  (hidden comment: Cap)
C61  value 10uF  [0603 CAP POLARIZED]  (hidden comment: Cap)
C62  value 1uF  [1608[0603]]  (hidden comment: Cap)
C63  value 1uF  [1608[0603]]  (hidden comment: Cap)
C64  value 1.8nF  [1608[0603]]  (hidden comment: Cap)
C65  value 0.1uF  [1608[0603]]  (hidden comment: Cap)
C66  value 10uF  [0603 CAP POLARIZED]  (hidden comment: Cap)
C67  value 1uF  [1608[0603]]  (hidden comment: Cap)
C68  value 1uF  [1608[0603]]  (hidden comment: Cap)
C69  value 1.8nF  [1608[0603]]  (hidden comment: Cap)
C70  value 0.1uF  [1608[0603]]  (hidden comment: Cap)
C71  value 1uF  [1608[0603]]  (hidden comment: Cap)
C72  value 10uF  [0603 CAP POLARIZED]  (hidden comment: Cap)
C73  value 1uF  [1608[0603]]  (hidden comment: Cap)
C74  value 1.8nF  [1608[0603]]  (hidden comment: Cap)
C75  value 0.1uF  [1608[0603]]  (hidden comment: Cap)
C76  value 0.1uF  [1608[0603]]  (hidden comment: Cap)
J7  1-5747150-6  [FP-1-5747150-6-MFG]
J8  1-5747150-6  [FP-1-5747150-6-MFG]
J9  1-5747150-6  [FP-1-5747150-6-MFG]
LED1  150120YS75000  [1206_A]
LED2  150120YS75000  [1206_A]
LED3  150120YS75000  [1206_A]
LED4  150120YS75000  [1206_A]
LED5  150120YS75000  [1206_A]
LED6  150120YS75000  [1206_A]
LED7  150120YS75000  [1206_A]
LED8  150120YS75000  [1206_A]
R8  ERA-3AED2490V  [RESC1608X55X30LL20T20]  (value not drawn)
R9  ERA-3AED2490V  [RESC1608X55X30LL20T20]  (value not drawn)
R10  ERA-3AED2490V  [RESC1608X55X30LL20T20]  (value not drawn)
R11  ERA-3AED2490V  [RESC1608X55X30LL20T20]  (value not drawn)
R12  value 680  [J1-0603]  (hidden comment: Res3)
R13  value 680  [J1-0603]  (hidden comment: Res3)
R14  value 680  [J1-0603]  (hidden comment: Res3)
R15  value 680  [J1-0603]  (hidden comment: Res3)
R16  value 680  [J1-0603]  (hidden comment: Res3)
R17  value 680  [J1-0603]  (hidden comment: Res3)
R18  value 680  [J1-0603]  (hidden comment: Res3)
R19  value 680  [J1-0603]  (hidden comment: Res3)
R60  value 22  [J1-0603]  (hidden comment: Res3)
R61  value 22  [J1-0603]  (hidden comment: Res3)
R62  value 22  [J1-0603]  (hidden comment: Res3)
R63  value 22  [J1-0603]  (hidden comment: Res3)
U6  LMV551MFX/NOPB  [DBV0005A_L]
U7  LMV551MFX/NOPB  [DBV0005A_L]
U8  LMV551MFX/NOPB  [DBV0005A_L]
U9  LMV551MFX/NOPB  [DBV0005A_L]
U10  MCP1501T-20E/CHY  [FP-C04-028-CHY-MFG]
U23  MCP33121-05  [MCP33121-05]
U24  MC10XSD200FK  [PQFN50P1200X1200X220_HS-33N]
U25  MCP33121-05  [MCP33121-05]
U26  MC10XSD200FK  [PQFN50P1200X1200X220_HS-33N]
U27  MCP33121-05  [MCP33121-05]
U28  MC10XSD200FK  [PQFN50P1200X1200X220_HS-33N]
U29  MCP33121-05  [MCP33121-05]
U30  MC10XSD200FK  [PQFN50P1200X1200X220_HS-33N]

### Ports
MISO0 (out), MISO1 (out), MISO2 (out), MOSI0 (in), MOSI1 (in), MOSI2 (in), SCK0 (in), SCK1 (in), SCK2 (in), SPI0_CS0 (in), SPI0_CS1 (in), SPI0_CS2 (in), SPI0_CS3 (in), SPI1_CS0 (in), SPI1_CS1 (in), SPI2_CS0 (in), SPI2_CS1 (in)

### Nets
+1.8V: C57.2 C63.2 C67.2 C73.2 U10.1(OUT) U23.2(AVDD) U25.2(AVDD) U27.2(AVDD) U29.2(AVDD)
+3.3V_D: C59.2 C65.2 C70.2 C75.2 U23.9(SDI) U23.10(DVIO) U24.13(VDD) U25.9(SDI) U25.10(DVIO) U26.13(VDD) U27.9(SDI) U27.10(DVIO) U28.13(VDD) U29.9(SDI) U29.10(DVIO) U30.13(VDD)
+5V: C56.1 C61.1 C66.1 C72.1 C76.2 U6.5(V+) U7.5(V+) U8.5(V+) U9.5(V+) U10.4(~{SHDN}) U10.6(VDD) U23.1(VREF) U25.1(VREF) U27.1(VREF) U29.1(VREF)
+24V_a: U24.15(VPWR) U24.18(VPWR) U24.21(VPWR)
+24V_b: U26.15(VPWR) U26.18(VPWR) U26.21(VPWR)
+24V_c: U28.15(VPWR) U28.18(VPWR) U28.21(VPWR)
+24V_d: U30.15(VPWR) U30.18(VPWR) U30.21(VPWR)
GND: C16.1 C17.1 C18.1 C19.1 C20.1 C21.1 C22.1 C23.1 C56.2 C57.1 C58.1 C59.1 C60.1 C61.2 C62.1 C63.1 C64.1 C65.1 C66.2 C67.1 C68.1 C69.1 C70.1 C71.1 C72.2 C73.1 C74.1 C75.1 C76.1 J7.1 J7.3 J7.5 J7.7 J8.1 J8.3 J8.5 J8.7 J9.2 J9.4 J9.6 J9.8 R8.1 R9.1 R10.1 R11.1 R12.1 R13.1 R14.1 R15.1 R16.1 R17.1 R18.1 R19.1 U6.2(V-) U7.2(V-) U8.2(V-) U9.2(V-) U10.2(GND) U10.3(GND) U10.5(GND) U23.4(AIN-) U23.5(GND) U24.14(GND) U24.17(GND) U24.22(GND) U25.4(AIN-) U25.5(GND) U26.14(GND) U26.17(GND) U26.22(GND) U27.4(AIN-) U27.5(GND) U28.14(GND) U28.17(GND) U28.22(GND) U29.4(AIN-) U29.5(GND) U30.14(GND) U30.17(GND) U30.22(GND)  [project net AGND]
MISO0: U24.16(SO) U26.16(SO) U28.16(SO) U30.16(SO) ; port MISO0
MISO1: U23.7(SDO) U27.7(SDO) ; port MISO1
MISO2: U25.7(SDO) U29.7(SDO) ; port MISO2
MOSI0: U24.12(SI) U26.12(SI) U28.12(SI) U30.12(SI) ; port MOSI0
SCK0: U24.11(SCLK) U26.11(SCLK) U28.11(SCLK) U30.11(SCLK) ; port SCK0
SCK1: U23.8(SCLK) U27.8(SCLK) ; port SCK1
SCK2: U25.8(SCLK) U29.8(SCLK) ; port SCK2
Sensor_a1: C60.2 J7.4 R8.2 U6.4(IN-)
Sensor_a2: C62.2 J7.8 R9.2 U7.4(IN-)
Sensor_b1: C68.2 J8.4 R10.2 U8.4(IN-)
Sensor_b2: C71.2 J8.8 R11.2 U9.4(IN-)
SPI0_CS0: U24.10(CSB) ; port SPI0_CS0
SPI0_CS1: U26.10(CSB) ; port SPI0_CS1
SPI0_CS2: U28.10(CSB) ; port SPI0_CS2
SPI0_CS3: U30.10(CSB) ; port SPI0_CS3
SPI1_CS0: U23.6(CNVST) ; port SPI1_CS0
SPI1_CS1: U27.6(CNVST) ; port SPI1_CS1
SPI2_CS0: U25.6(CNVST) ; port SPI2_CS0
SPI2_CS1: U29.6(CNVST) ; port SPI2_CS1
Vout_a1: C16.2 J7.6 LED2.2(A) U24.20(HS0)
Vout_a2: C17.2 J7.2 LED1.2(A) U24.19(HS1)
Vout_b1: C18.2 J8.6 LED4.2(A) U26.20(HS0)
Vout_b2: C19.2 J8.2 LED3.2(A) U26.19(HS1)
Vout_c1: C20.2 J9.7 LED6.2(A) U28.20(HS0)
Vout_c2: C21.2 J9.1 LED5.2(A) U28.19(HS1)
Vout_d1: C22.2 J9.3 LED8.2(A) U30.20(HS0)
Vout_d2: C23.2 J9.5 LED7.2(A) U30.19(HS1)
NetC58_2: C58.2 R60.1 U23.3(AIN+)
NetC64_2: C64.2 R61.1 U25.3(AIN+)
NetC69_2: C69.2 R62.1 U27.3(AIN+)
NetC74_2: C74.2 R63.1 U29.3(AIN+)
NetLED1_1: LED1.1(K) R12.2
NetLED2_1: LED2.1(K) R13.2
NetLED3_1: LED3.1(K) R14.2
NetLED4_1: LED4.1(K) R15.2
NetLED5_1: LED5.1(K) R16.2
NetLED6_1: LED6.1(K) R17.2
NetLED7_1: LED7.1(K) R18.2
NetLED8_1: LED8.1(K) R19.2
NetR60_2: R60.2 U6.1(OUT) U6.3(IN+)
NetR61_2: R61.2 U7.1(OUT) U7.3(IN+)
NetR62_2: R62.2 U8.1(OUT) U8.3(IN+)
NetR63_2: R63.2 U9.1(OUT) U9.3(IN+)

Not connected (* = marked no-connect by the designer): J7 9*; J8 9*; J9 9*; U24 1(CSNS)* 2(IN0)* 3(IN1)* 4(FSOB)* 5(CONF0)* 6(CONF1)* 7(FSB)* 8(CLOCK)* 9(RSTB)* 23(SYNC)*; U26 1(CSNS)* 2(IN0)* 3(IN1)* 4(FSOB)* 5(CONF0)* 6(CONF1)* 7(FSB)* 8(CLOCK)* 9(RSTB)* 23(SYNC)*; U28 1(CSNS)* 2(IN0)* 3(IN1)* 4(FSOB)* 5(CONF0)* 6(CONF1)* 7(FSB)* 8(CLOCK)* 9(RSTB)* 23(SYNC)*; U30 1(CSNS)* 2(IN0)* 3(IN1)* 4(FSOB)* 5(CONF0)* 6(CONF1)* 7(FSB)* 8(CLOCK)* 9(RSTB)* 23(SYNC)*

### Notes on the sheet
- Actuators
- ADCs
- (near R8) DNP (4-20ma)
- (near R9) DNP (4-20ma)
- (near R10) DNP (4-20ma)
- (near R11) DNP (4-20ma)
- (near C76) 1.8V, <5%, >4*2.4mA
- SPI (to MCU)

### Library data of the parts
C16-C23 = Cap: MULTICOMP - MC0603F223Z500CT - KONDENSATOR, 0.022µF, 50V, Y5V, 0603; Tolerance: -20%; Capacitance: 22nF; Published: 8-Jun-2000; LatestRevisionDate: 17-Jul-2002; LatestRevisionNote: Re-released for DXP Platform.; PackageReference: RAD-0.3; Publisher: Altium Limited; PackageDescription: Radial Cap, Thru-Hole; 2 Leads; 0.3 in Pin Spacing; Manufacturer: Multicomp; Manufacturer Part Number: MC0603F223Z500CT; RoHS: Yes; Category: Capacitors; Stock 1: 9682; Pricing 1: 10=0.01100, 25=0.01100, 100=0.01100, 250=0.01100, 500=0.01100, 1000=0.01100 (CAD); Case/Package: 0603; Case Code (Metric): 1608; Case Code (Imperial): 0603; Min Operating Temperature: -30°C; Max Operating Temperature: 85°C; Packaging: Cut Tape; Voltage Rating (DC): 50V; Dielectric: Y5V; Voltage Rating: 50V; REACH SVHC: Unknown; ComponentLink1URL: https://datasheet.ciiva.com/46443/1870456-46443401.pdf?src-supplier=Element14; ComponentLink1Description: https://datasheet.ciiva.com/46443/1870456-46443401.pdf?src-supplier=Element14; ComponentLink2URL: https://datasheet.ciiva.com/46443/1870456-46443402.pdf?src-supplier=Element14; ComponentLink2Description: https://datasheet.ciiva.com/46443/1870456-46443402.pdf?src-supplier=Element14; Supplier 1: Digi-Key; Supplier Part Number 1: 720-1526-1-ND
C56 C61 C66 C72 = Cap: 10µF Molded Tantalum Capacitors 10V 0603 (1608 Metric) 7.5Ohm @ 100kHz; Published: 8-Jun-2000; LatestRevisionDate: 17-Jul-2002; LatestRevisionNote: Re-released for DXP Platform.; PackageReference: RAD-0.3; Publisher: Altium Limited; PackageDescription: Radial Cap, Thru-Hole; 2 Leads; 0.3 in Pin Spacing; Supplier 1: Digi-Key; Supplier Part Number 1: 478-F981A106MMUAJ6CT-ND
C57 C60 C62 C63 C67 C68 C71 C73 = Cap: 1µF ±10% 10V Ceramic Capacitor X7R 0603 (1608 Metric); Published: 8-Jun-2000; LatestRevisionDate: 17-Jul-2002; LatestRevisionNote: Re-released for DXP Platform.; PackageReference: RAD-0.3; Publisher: Altium Limited; PackageDescription: Radial Cap, Thru-Hole; 2 Leads; 0.3 in Pin Spacing; Supplier 1: Digi-Key; Supplier Part Number 1: 587-1242-1-ND
C58 C64 C69 C74 = Cap: 1800pF ±10% 50V Ceramic Capacitor X7R 0603 (1608 Metric); Published: 8-Jun-2000; LatestRevisionDate: 17-Jul-2002; LatestRevisionNote: Re-released for DXP Platform.; PackageReference: RAD-0.3; Publisher: Altium Limited; PackageDescription: Radial Cap, Thru-Hole; 2 Leads; 0.3 in Pin Spacing; Supplier 1: Digi-Key; Supplier Part Number 1: 399-7867-1-ND
C59 C65 C70 C75 C76 = Cap: 0.1µF ±10% 25V Ceramic Capacitor X7R 0603 (1608 Metric); Published: 8-Jun-2000; LatestRevisionDate: 17-Jul-2002; LatestRevisionNote: Re-released for DXP Platform.; PackageReference: RAD-0.3; Publisher: Altium Limited; PackageDescription: Radial Cap, Thru-Hole; 2 Leads; 0.3 in Pin Spacing; Supplier 1: Digi-Key; Supplier Part Number 1: 478-3714-1-ND
J7-J9 = CMP-03367-000009-1: CONN D-SUB RCPT 9POS VERT SOLDER; Manufacturer: TE Connectivity; Is Female: yes; Current Rating: 6A; Conn Orientation: Vertical; Conn Gender: Female; Shielding: false; Number Of Contacts: 9; Pitch: 2.74mm; ComponentLink2URL: https://www.te.com/usa-en/product-1-5747150-6.html?te_bu=Cor&te_type=other&te_campaign=oct_glo_cor-oct-global-oth-prtnr-fy19-oct-octo-buy-bom_sma-298_2&elqCampaignId=35216; Manufacturer Part Number: 1-5747150-6; Temperature: -55°C to +105°C; Mouser Description: D-Sub Standard Connectors RECP FRNT MTL SHL 9P female screwlocks; Octopart: https://octopart.com/1-5747150-6-te+connectivity-39500344; Category: Conn; Automotive: No; Package: 1-5747150-6; Device Class L3: unset; Contact Material: Gold,Nickel; Lead Free: Yes; Height: 12.54mm; RoHS: TRUE; ComponentLink2Description: Datasheet; Device Class L2: D-Sub Connectors; Device Class L1: Connectors; Digikey Description: CONN D-SUB RCPT 9POS VERT SOLDER; Temperature Range High: +105°C; Temperature Range Low: -55°C
LED1-LED8 = CMP-1426-00019-1: SMD mono-color Chip LED, WL-SMCW, Yellow; Manufacturer: Wuerth Elektronik; ComponentLink2URL: http://katalog.we-online.com/led/datasheet/150120YS75000.pdf; PartNumber: 150120YS75000; ComponentLink1URL: http://www.we-online.com; Color: Yellow; ComponentLink1Description: Manufacturer URL; PackageReference: 1206_A; ComponentLink2Description: Datasheet
R8-R11 = CMP-2000-00150-1: Manufacturer: Panasonic; Part Number: ERA-3AED2490V
R12-R19 = Res3: Resistor; Published: 8-Jun-2000; LatestRevisionDate: 29-May-2009; LatestRevisionNote: IPC-7351 Footprint Added.; PackageReference: J1-0603; Publisher: Altium Limited; PackageDescription: Chip Resistor; Supplier 1: Digi-Key; Supplier Part Number 1: 1292-WR06X6800FTLCT-ND
R60-R63 = Res3: 22 Ohms ±0.1% 0.1W, 1/10W Chip Resistor 0603 (1608 Metric)  Thin Film; Published: 8-Jun-2000; LatestRevisionDate: 29-May-2009; LatestRevisionNote: IPC-7351 Footprint Added.; PackageReference: J1-0603; Publisher: Altium Limited; PackageDescription: Chip Resistor; Supplier 1: Digi-Key; Supplier Part Number 1: 13-RT0603BRD0722RLCT-ND
U6-U9 = CMP-0055-01011-3: 3 MHz, Micropower RRO Amplifier, 5-pin SOT-23, Pb-Free; Manufacturer: Texas Instruments; PowerWise: N; PackageTopMarking: AF3A*XTT; CompType: Amplifiers; RoHS: Y; PinCount: 5; ComponentLink1Description: Datasheet URL; Package Reference: DBV0005A; PackageDescription: Molded SOT-23, .115 x .063 x .040 in Body, 5 Lead, .0375 in Pitch; ComponentLink1URL: http://www.ti.com/general/docs/lit/getliterature.tsp?genericPartNumber=LMV551&fileType=pdf
U10 = CMP-06323-000004-1: IC VREF SERIES 0.1% SOT23-6; Manufacturer: Microchip; Output Current: 20mA; Number Of Outputs: 1; Output Type: Fixed; Max Supply Voltage: 5.5V; Standoff Height: 0mm; Min Supply Voltage: 2.25V; Output Voltage: 2.048V; Nominal Supply Current: 140uA; Reference Type: Series; ComponentLink2Description: Datasheet; Height: 1.45mm; Manufacturer Part Number: MCP1501T-20E/CHY; ComponentLink2URL: http://ww1.microchip.com/downloads/en/DeviceDoc/20005474E.pdf; Digikey Description: IC VREF SERIES 0.1% SOT23-6; Device Class L2: Power Management ICs; Temperature: -40°C to +125°C; Lead Free: Yes; Ambient Temperature Range Low: -40°C; RoHS: TRUE; Temperature Range Low: -40°C; Category: IC; Ambient Temperature Range High: +125°C; Temperature Range High: +125°C; Package: C04-028-CHY; Device Class L1: Integrated Circuits (ICs); Ipc Land Pattern Name: SOT95P280X118-6; Device Class L3: Voltage References; Octopart: https://octopart.com/mcp1501t-20e%2Fchy-microchip-70491618; Footprint Url: http://ww1.microchip.com/downloads/en/DeviceDoc/6L_SOT-23_OT_OTY_C04-028C_OT.pdf; Automotive: No
U24 U26 U28 U30 = MC06XS4200: Supplier 1: Avnet; Supplier Part Number 1: MC10XSD200FK